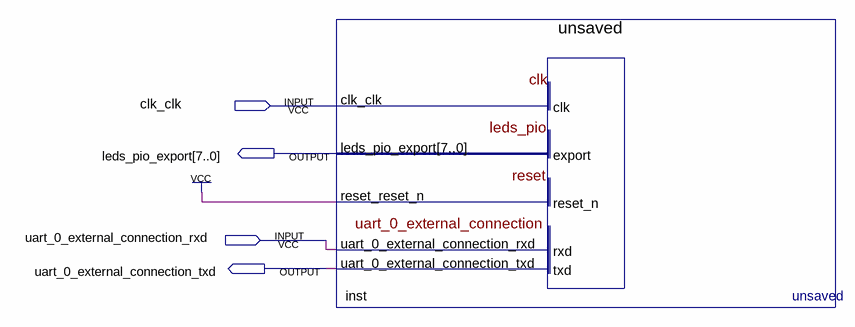
[diagram p0: schematic sheet]
// Quartus schematic uart_wifi_test.bdf as structural Verilog: 1 symbols, 4 pins
module uart_wifi_test (
  input  clk_clk,
  input  uart_0_external_connection_rxd,
  output [7:0] leds_pio_export,
  output uart_0_external_connection_txd
);

  unsaved inst (
    .clk_clk(clk_clk), .reset_reset_n(1'b1), .uart_0_external_connection_rxd(uart_0_external_connection_rxd),
    .leds_pio_export(leds_pio_export), .uart_0_external_connection_txd(uart_0_external_connection_txd));
endmodule
